# EAGLE schematic espiotv1 (EAGLE 7.6.0)
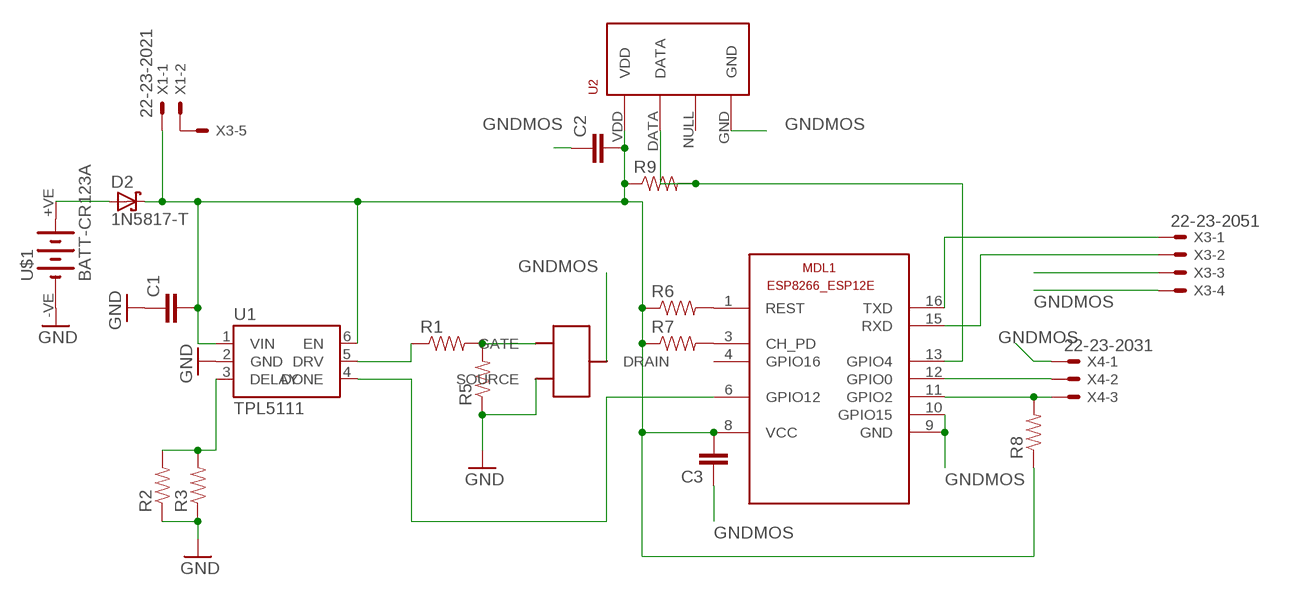
[diagram p0: schematic, sheet 1]

## Parts
C1  CAP0603-CAP  [0603-CAP]
C2  CAP0603-CAP  [0603-CAP]
C3  CAP0603-CAP  [0603-CAP]
D2  1N5817-T  [DO41-7.6]
MDL1  ESP8266-12EESP8266-ESP12E  [ESP8266-ESP12E]
R1  RESISTOR0603-RES  [0603-RES]
R2  RESISTOR0603-RES  [0603-RES]
R3  RESISTOR0603-RES  [0603-RES]
R5  RESISTOR0603-RES  [0603-RES]
R6  RESISTOR0603-RES  [0603-RES]
R7  RESISTOR0603-RES  [0603-RES]
R8  RESISTOR0603-RES  [0603-RES]
R9  RESISTOR0603-RES  [0603-RES]
U1  TPL5111  TPL5111SOT-23  [SOT23-6]
U2  RHT03_DHT-22_AM2302RA  [RHT03_DHT-22/RA]
U$1  BATT-CR123A  [KEYSTONE-2/3A]
U$3  IRLML2502  [IRLML2502]
X1  22-23-2021  [22-23-2021]
X3  22-23-2051  [22-23-2051]
X4  22-23-2031  [22-23-2031]

## Nets
GND: C1.1 R2.1 R3.1 R5.1 U1.2(GND) U$1.-VE(-) U$3.S(SOURCE)
GNDMOS: C2.1 C3.1 MDL1.9(GND) MDL1.10(GPIO15) U2.GND U$3.D(DRAIN) X3.3 X3.4 X4.1
N$1: D2.A U$1.+VE(+)
N$2: C1.2 C2.2 C3.2 D2.C MDL1.8(VCC) R6.1 R7.1 R8.1 R9.1 U1.1(VIN) U1.6(EN) U2.VDD X1.1
N$3: R2.2 R3.2 U1.3(DELAY)
N$4: R1.1 U1.5(DRV)
N$5: R1.2 R5.2 U$3.G(GATE)
N$6: MDL1.6(GPIO12) U1.4(DONE)
N$7: MDL1.16(TXD) X3.1
N$8: MDL1.15(RXD) X3.2
N$9: MDL1.1(REST) R6.2
N$10: MDL1.3(CH_PD) R7.2
N$11: MDL1.13(GPIO4) R9.2 U2.DATA
N$12: X1.2 X3.5
N$13: MDL1.11(GPIO2) R8.2 X4.3
N$14: MDL1.12(GPIO0) X4.2
Unconnected: MDL1.4(GPIO16) U2.NULL

## Library data of the parts
C1-C3 = SparkFun:CAP: Capacitor Standard 0603 ceramic capacitor, and 0.1" leaded capacitor.
D2 = diode:1N581*: 1.0A SCHOTTKY BARRIER RECTIFIER Source: http://www.diodes.com/datasheets/ds23001.pdf
MDL1 = ESP-12E (2):ESP8266-12E: ESP8266-12E with additional I/O and GPIO04/05 corrected The author cannot warrant that this library is free from error or will meet your specific requirements. Created by PuceBaboon.com. Komagane, Nagano, JAPAN
R1-R3 R5-R9 = SparkFun:RESISTOR: Resistor Basic schematic elements and footprints for 0603, 1206, and PTH resistors.
U1 = TPL5111:TPL5111: TPL5111, SOT23-6; PROD_ID: TPL5111
U2 = dht-22:RHT03_DHT-22_AM2302: RHT03 / DHT-22 / AM2302 Packages and symbol for the RHT03 / DHT-22 relative humidity and temperature sensor. Note: The AM2302 is a wired version of the DHT-22 which typically requires less clearance and is thus provided as a separate package.; PROD_ID: SEN-10167
U$1 = battery-3:BATT-CR123A: CR123A (2/3rd AA) battery holder Manufacturer: Keystone Mouser part: 534-1019
U$3 = IRLML2502:IRLML2502
X1 = con-molex:22-23-2021: .100" (2.54mm) Center Header - 2 Pin; MF: MOLEX; MPN: 22-23-2021; OC_FARNELL: 1462926; OC_NEWARK: 25C3832
X3 = con-molex:22-23-2051: .100" (2.54mm) Center Header - 5 Pin; MF: MOLEX; MPN: 22-23-2051; OC_FARNELL: 1462952; OC_NEWARK: 38C9178
X4 = con-molex:22-23-2031: .100" (2.54mm) Center Header - 3 Pin; MF: MOLEX; MPN: 22-23-2031; OC_FARNELL: 1462950; OC_NEWARK: 30C0862